# Altium schematic sheet Teensy32.SchDoc
size A; SheetNumber: 2
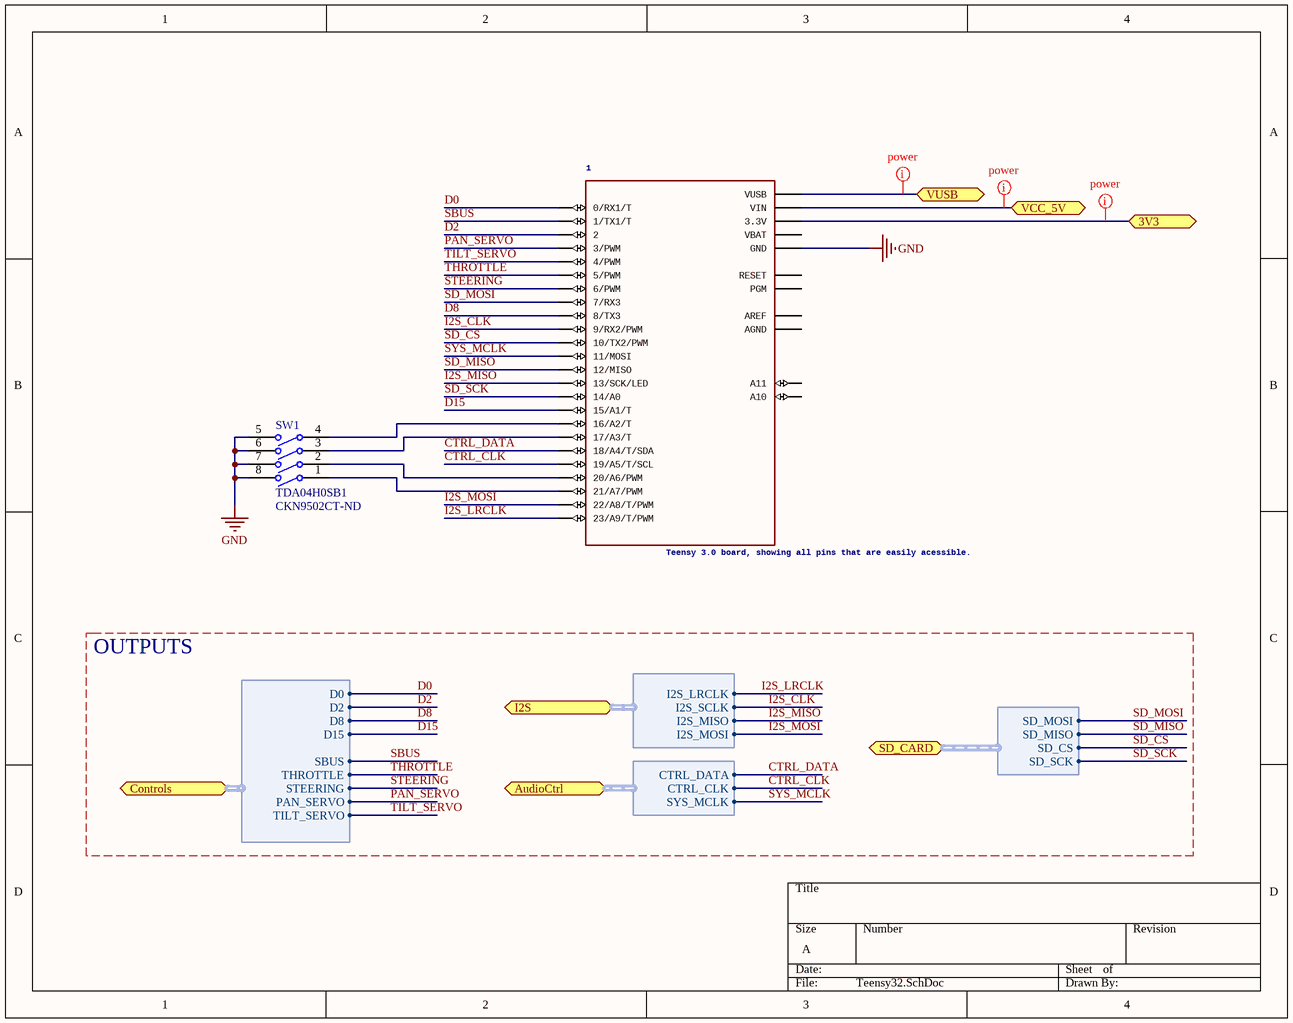
[diagram p0: Teensy32.SchDoc]

## Parts
1  Teensy 3.0 board, showing all pins that are easily acessible.  [TEENSY_3.0-3.2&LC_ALL_PINS]
SW1  TDA04H0SB1  Supplier Part Number 1: CKN9502CT-ND  [CKCP-TDA04H0SB1R_V]

## Ports
3V3, AudioCtrl (harness AudioCtrl), Controls (harness Controls), I2S (harness I2S), SD_CARD (harness SD_CARD), VCC_5V, VUSB

## Harnesses
SD_CARD: SD_MISO, SD_MOSI, SD_CS, SD_SCK
I2S: I2S_LRCLK, I2S_SCLK, I2S_MISO, I2S_MOSI
Controls: SBUS, THROTTLE, STEERING, PAN_SERVO, TILT_SERVO, D15, D8, D2, D0
AudioCtrl: CTRL_DATA, CTRL_CLK, SYS_MCLK

## Nets
GND: 1.GND_GND1(GND) SW1.5 SW1.6 SW1.7 SW1.8
3V3: 1.3.3V_3.3V1(3.3V) ; port 3V3
CTRL_CLK: 1.19/A5(19/A5/T/SCL) ; port AudioCtrl.CTRL_CLK
CTRL_DATA: 1.18/A4(18/A4/T/SDA) ; port AudioCtrl.CTRL_DATA
D0: 1.0(0/RX1/T) ; port Controls.D0
D2: 1.2 ; port Controls.D2
D8: 1.8(8/TX3) ; port Controls.D8
D15: 1.15/A1(15/A1/T) ; port Controls.D15
I2S_CLK: 1.9(9/RX2/PWM) ; port I2S.I2S_SCLK
I2S_LRCLK: 1.23/A9(23/A9/T/PWM) ; port I2S.I2S_LRCLK
I2S_MISO: 1.13(13/SCK/LED) ; port I2S.I2S_MISO
I2S_MOSI: 1.22/A8(22/A8/T/PWM) ; port I2S.I2S_MOSI
PAN_SERVO: 1.3(3/PWM) ; port Controls.PAN_SERVO
SBUS: 1.1(1/TX1/T) ; port Controls.SBUS
SD_CS: 1.10(10/TX2/PWM) ; port SD_CARD.SD_CS
SD_MISO: 1.12(12/MISO) ; port SD_CARD.SD_MISO
SD_MOSI: 1.7(7/RX3) ; port SD_CARD.SD_MOSI
SD_SCK: 1.14/A0 ; port SD_CARD.SD_SCK
STEERING: 1.6(6/PWM) ; port Controls.STEERING
SYS_MCLK: 1.11(11/MOSI) ; port AudioCtrl.SYS_MCLK
THROTTLE: 1.5(5/PWM) ; port Controls.THROTTLE
TILT_SERVO: 1.4(4/PWM) ; port Controls.TILT_SERVO
VCC_5V: 1.VIN ; port VCC_5V
VUSB: 1.VUSB ; port VUSB
Net1_16/A2: 1.16/A2(16/A2/T) SW1.4
Net1_17/A3: 1.17/A3(17/A3/T) SW1.3
Net1_20/A6: 1.20/A6(20/A6/PWM) SW1.2
Net1_21/A7: 1.21/A7(21/A7/PWM) SW1.1

Not connected (* = marked no-connect by the designer): 1 A10 A11 AGND AREF PGM RESET/DAC(RESET) VBAT

## Layout directives
net class power: 3V3, VCC_5V, VUSB

## Notes on the sheet
- OUTPUTS

## Library data of the parts
1 = TEENSY_3.0_ALL_PINS: GateName_1: G$1; SymbolName_1: TEENSY_3.0_ALL_PINS; LibraryName: Teensy_3_and_LC_Series_Boards_v1.4; DeviceSetName: TEENSY_3.0_ALL_PINS
SW1 = CMP-1727-00001-1: Ultra-Miniature Surface Mount Half-Pitch DIP Switch, 25 mA, 24 V, -40 to 85 degC, 8-Pin SMD, RoHS, Tube; Contact Current Rating: 100 mA; Throw Configuration: SPST; Voltage Rating (DC): 24 V; Max Contact Resistance: 100 mohm; Max Current Rating: 25 mA; REACH SVHC: No SVHC; DatasheetVersion: 02/2016; Case\Package: DIP; Package Quantity: 70; Lead Pitch: 1.27 mm; Contact Plating: Gold; Packaging: Rail/Tube; Contact Finish: Gold; Mount: Surface Mount; Height: 2.3 mm; Contact Material: Copper; Max Operating Temperature: 85 degC; Max Voltage Rating (DC): 24 V; ComponentLink1URL: http://www.ck-components.com/media/1328/tda.pdf; PackageDescription: 8-Pin Surface Mount Device, Body 6.21 x 6.2 mm, Pitch 1.27 mm; Radiation Hardening: No; ComponentLink1Description: Datasheet; Current Rating: 100 mA; RoHSCompliant: true; PackageReference: TDA04H0SB1R; Min Operating Temperature: -40 degC; Pins: 4; Mounting Technology: Surface Mount; Length: 6.21 mm; Supplier 1: Digi-Key